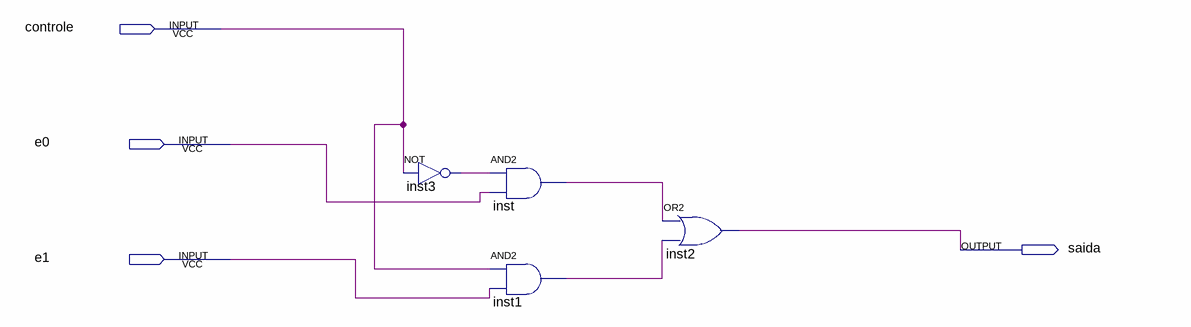
[diagram p0: schematic sheet]
// Quartus schematic mux-do-daniel.bdf as structural Verilog: 4 symbols, 4 pins
module \mux-do-daniel  (
  input  controle,
  input  e0,
  input  e1,
  output saida
);

  wire inst1_out, inst3_out, inst_out;

  not inst3 (inst3_out, controle);
  and inst (inst_out, inst3_out, e0);
  and inst1 (inst1_out, controle, e1);
  or inst2 (saida, inst_out, inst1_out);
endmodule
